# Altium schematic sheet practice_0.SchDoc: MCU STM32-F4 Example Board
size 381 x 241 mm; SheetNumber: 1; SheetTotal: 1
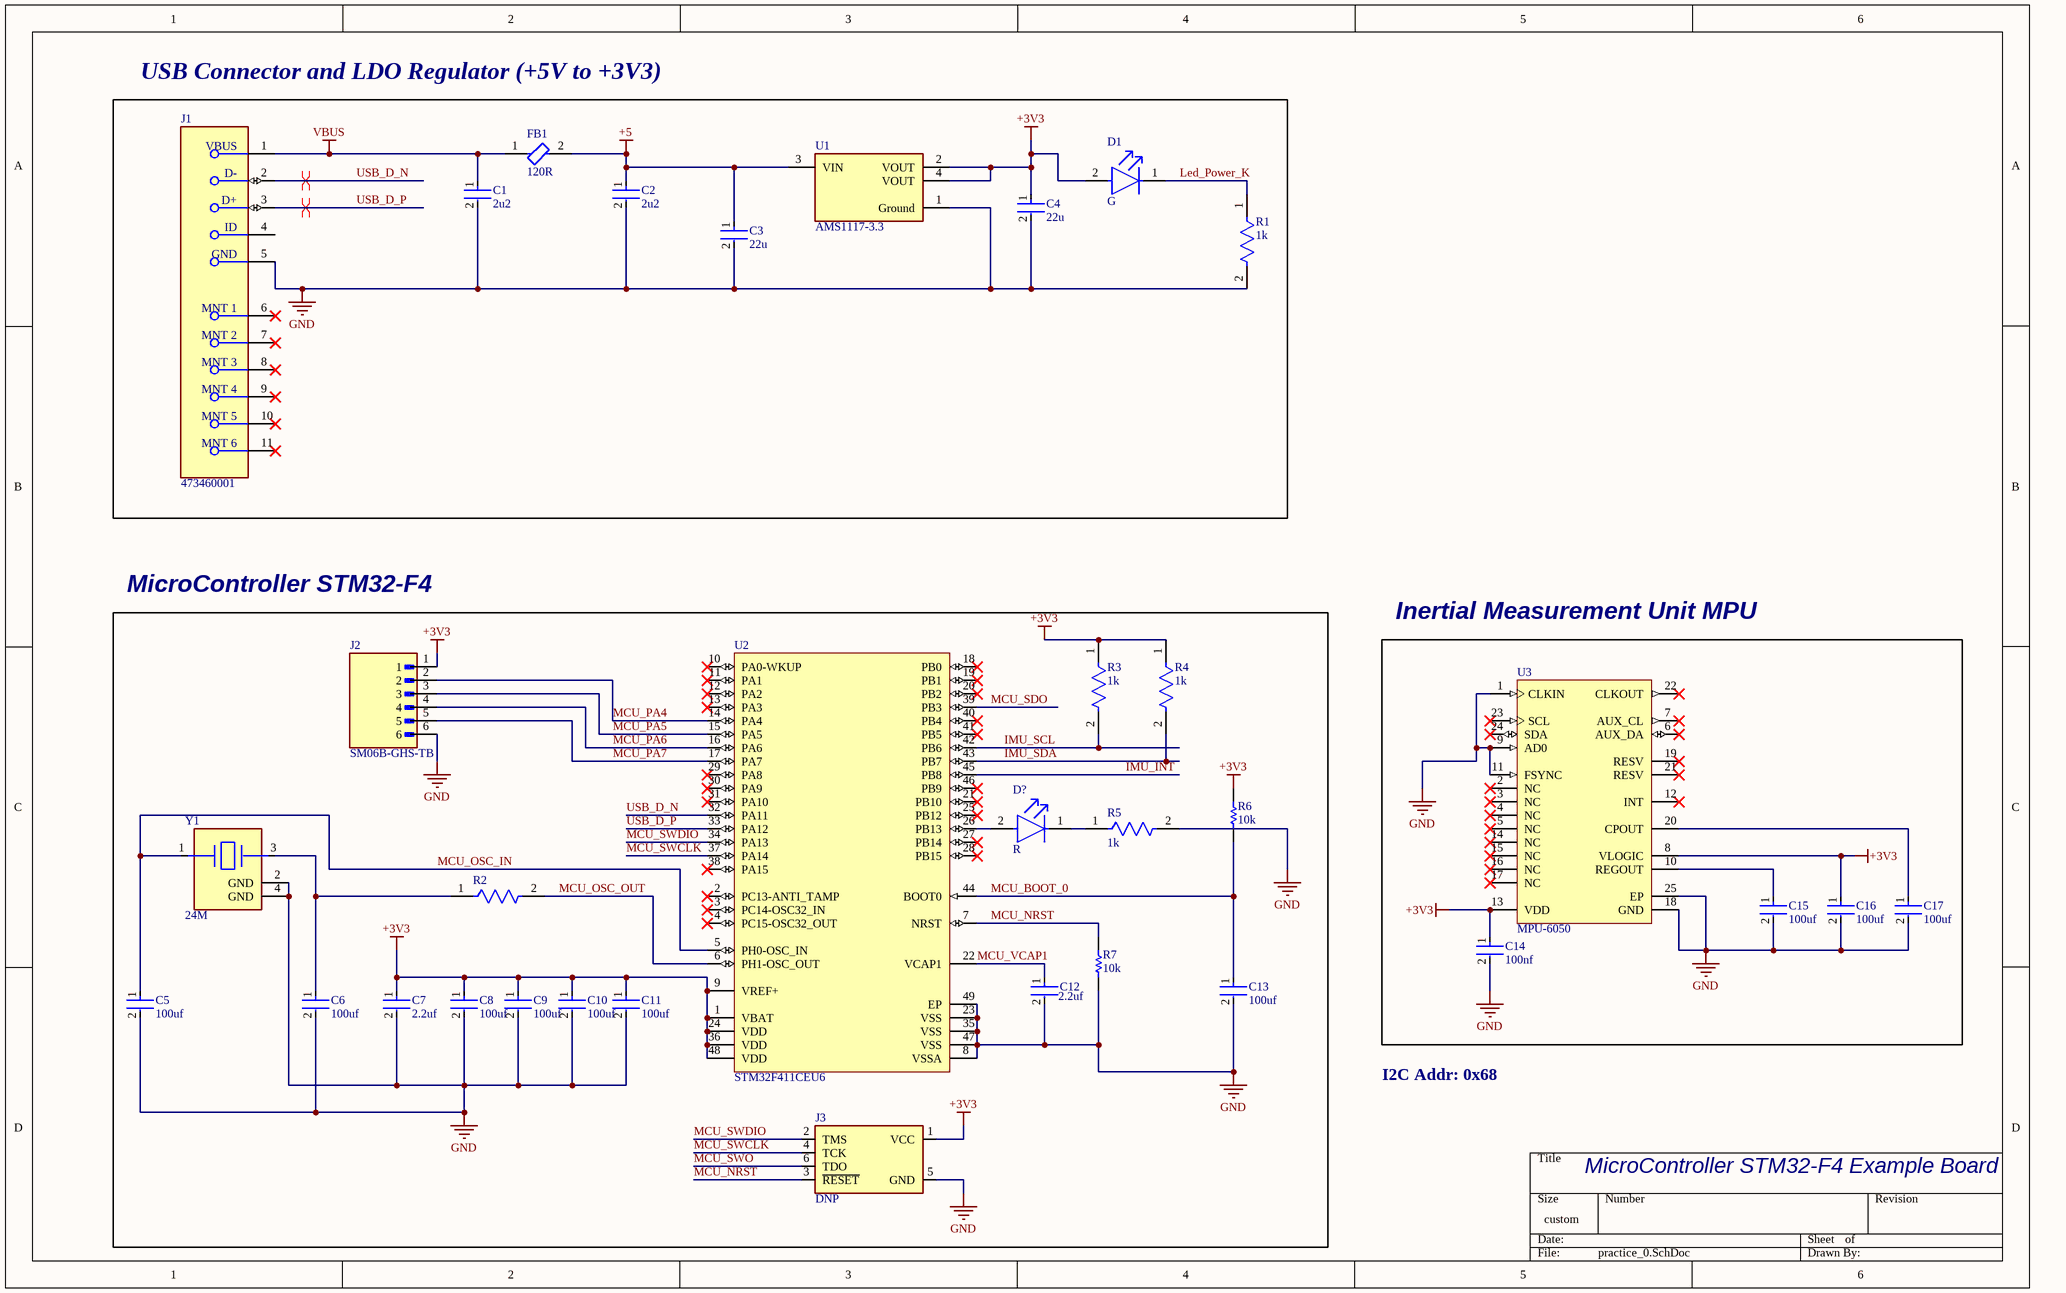
[diagram p0: practice_0.SchDoc]

## Parts
C1  2u2  [FP-CC0402-CC-MFG]
C2  2u2  [FP-CC0402-CC-MFG]
C3  22u  [FP-CC0402-CC-MFG]
C4  22u  [FP-CC0402-CC-MFG]
C5  100uf  [FP-C0402-BB-MFG]
C6  100uf  [FP-C0402-BB-MFG]
C7  2.2uf  [FP-CC0402-CC-MFG]
C8  100uf  [FP-C0402-BB-MFG]
C9  100uf  [FP-C0402-BB-MFG]
C10  100uf  [FP-C0402-BB-MFG]
C11  100uf  [FP-C0402-BB-MFG]
C12  2.2uf  [FP-CC0402-CC-MFG]
C13  100uf  [FP-C0402-BB-MFG]
C14  100nf  [FP-C0402-BB-MFG]
C15  100uf  [FP-C0402-BB-MFG]
C16  100uf  [FP-C0402-BB-MFG]
C17  100uf  [FP-C0402-BB-MFG]
D1  G  [FP-LTST-C193KGKT-5A-MFG]
D?  R  [FP-LTST-C230EKT-MFG]
FB1  120R  [FP-BLM18-0_15-t0_8-MFG]
J1  473460001  [FP-473460001-MFG]
J2  SM06B-GHS-TB  [JST_SM06B-GHS-TB]
J3  DNP  [TC2030-IDC-NL]
R1  1k  [FP-CSR0402-MFG]
R2  (no value)  [FP-CSR0402-MFG]
R3  1k  [FP-CSR0402-MFG]
R4  1k  [FP-CSR0402-MFG]
R5  1k  [FP-CSR0402-MFG]
R6  10k  [RESC1005X40X20NL05T10]
R7  10k  [RESC1005X40X20NL05T10]
U1  AMS1117-3.3  [FP-AMS1117-IPC_C]
U2  STM32F411CEU6  [STM-UFQFPN48_L]
U3  MPU-6050  [IS-QFN-24_V]
Y1  24M  [FP-TSX-3225-MFG]

## Blocks framed on the sheet
USB Connector and LDO Regulator (+5V to +3V3): C1-C4 D1 FB1 J1 R1 U1
MicroController STM32-F4: C5-C13 D? J2 J3 R2-R7 U2 Y1
Inertial Measurement Unit MPU: C14-C17 U3

## Nets
+3V3: C4.1 C7.1 C8.1 C9.1 C10.1 C11.1 C14.1 C16.1 D1.2(A) J2.1 J3.1(VCC) R3.1 R4.1 R6.2 U1.2(VOUT) U1.4(VOUT) U2.1(VBAT) U2.9(VREF+) U2.24(VDD) U2.36(VDD) U2.48(VDD) U3.8(VLOGIC) U3.13(VDD)
+5: C2.1 C3.1 FB1.2 U1.3(VIN)
GND: C1.2 C2.2 C3.2 C4.2 C5.2 C6.2 C7.2 C8.2 C9.2 C10.2 C11.2 C12.2 C13.2 C14.2 C15.2 C16.2 C17.2 J1.5(GND) J2.6 J3.5(GND) R1.2 R5.2 R7.1 U1.1(Ground) U2.8(VSSA) U2.23(VSS) U2.35(VSS) U2.47(VSS) U2.49(EP) U3.1(CLKIN) U3.9(AD0) U3.11(FSYNC) U3.18(GND) U3.25(EP) Y1.2(GND) Y1.4(GND)
VBUS: C1.1 FB1.1 J1.1(VBUS)
IMU_INT: U2.45(PB8)
IMU_SCL: R3.2 U2.42(PB6)
IMU_SDA: R4.2 U2.43(PB7)
Led_Power_K: D1.1(C) R1.1
MCU_BOOT_0: C13.1 R6.1 U2.44(BOOT0)
MCU_NRST: J3.3(~{RESET}) R7.2 U2.7(NRST)
MCU_OSC_IN: C5.1 U2.5(PH0-OSC_IN) Y1.1
MCU_OSC_OUT: R2.2 U2.6(PH1-OSC_OUT)
MCU_PA4: J2.2 U2.14(PA4)
MCU_PA5: J2.3 U2.15(PA5)
MCU_PA6: J2.4 U2.16(PA6)
MCU_PA7: J2.5 U2.17(PA7)
MCU_SDO: U2.39(PB3)
MCU_SWCLK: J3.4(TCK) U2.37(PA14)
MCU_SWDIO: J3.2(TMS) U2.34(PA13)
MCU_SWO: J3.6(TDO)
MCU_VCAP1: C12.1 U2.22(VCAP1)
USB_D_N: J1.2(D-) U2.32(PA11)
USB_D_P: J1.3(D+) U2.33(PA12)
NetC6_1: C6.1 R2.1 Y1.3
NetC15_1: C15.1 U3.10(REGOUT)
NetC17_1: C17.1 U3.20(CPOUT)
NetD?_1: D?.1(C) R5.1
NetD?_2: D?.2(A) U2.26(PB13)

Not connected (* = marked no-connect by the designer): J1 4(ID) 6(MNT_1)* 7(MNT_2)* 8(MNT_3)* 9(MNT_4)* 10(MNT_5)* 11(MNT_6)*; U2 2(PC13-ANTI_TAMP)* 3(PC14-OSC32_IN)* 4(PC15-OSC32_OUT)* 10(PA0-WKUP)* 11(PA1)* 12(PA2)* 13(PA3)* 18(PB0)* 19(PB1)* 20(PB2)* 21(PB10)* 25(PB12)* 27(PB14)* 28(PB15)* 29(PA8)* 30(PA9)* 31(PA10)* 38(PA15)* 40(PB4)* 41(PB5)* 46(PB9)*; U3 2(NC)* 3(NC)* 4(NC)* 5(NC)* 6(AUX_DA)* 7(AUX_CL)* 12(INT)* 14(NC)* 15(NC)* 16(NC)* 17(NC)* 19(RESV)* 21(RESV)* 22(CLKOUT)* 23(SCL)* 24(SDA)*

## Layout directives
differential pair; differential pair class DIFF_USB: USB_D_N, USB_D_P

## Notes on the sheet
- I2C Addr: 0x68
- MicroController STM32-F4 Example Board

## Library data of the parts
C1-C4 C7 C12 = CMP-03422-000732-3: CAP CER 2.2UF 16V X5R 0402; Tolerance: 10%; Case Code (Imperial): 0402; Width: 0.5mm; Max Operating Temperature: 85°C; Length: 0.039inch; Thickness: 0.022inch; Termination: SMD/SMT; Halogen Free: Halogen Free; Voltage Rating (DC): 16V; Packaging: Tape and Reel; RoHS Compliant: Yes; Lead Free: Lead Free; Weight: 2.3E-05oz; Package Quantity: 5000; Height: 0.5mm; Case Code (Metric): 1005; Dielectric: X5R; Case/Package: 0402; Capacitance: 2.2uF; Mount: Surface Mount; Voltage Rating: 16V; Min Operating Temperature: -55°C
C5 C6 C8-C11 C13-C17 = CMP-1034-01425-3: Capacitor, Ceramic, 330Pf, 16Vdc, 10-% Tol, 10+% Tol, X7r-Tc Code, -15, 15%-Tc Rohs Compliant: Yes; Manufacturer Part Number: C0402C331K4RACTU; Manufacturer: Kemet; Voltage Rating: 16 V; Temperature Characteristic: X7R; Tolerance: 0.1; Temperature Coefficient: 15%; Category: Cap; ComponentLink2Description: Datasheet; Lead Free: Yes; Mouser Description: Multilayer Ceramic Capacitors MLCC - SMD/SMT 16volts 330pF X7R 10%; Capacitance: 330 pF; Ipc Land Pattern Name: CAPC10050X50; Temperature Range High: +125°C; Temperature: -55°C to +125°C; Digikey Description: Capacitor, Ceramic, 330Pf, 16Vdc, 10-% Tol, 10+% Tol, X7r-Tc Code, -15, 15%-Tc Rohs Compliant: Yes; Automotive: No; Package: C0402-BB; Height: 0.55mm; Material: Ceramic; ComponentLink2URL: https://content.kemet.com/datasheets/KEM_C1002_X7R_SMD.pdf; Device Class L1: Passive Components; Temperature Range Low: -55°C; Value: 330 pF; Device Class L3: Ceramic Capacitors; Device Class L2: Capacitors; Octopart: https://octopart.com/c0402c331k4ractu-kemet-9139363; RoHS: TRUE
D1 = CMP-2000-06622-2: LED GREEN CLEAR CHIP SMD; Forward Current: 30mA; Power Dissipation: 75mW; Luminous Intensity: 28mcd; Lens Style: Diffused; Lens Color: Colorless; Forward Voltage: 2.3V; Test Current: 5mA; Viewing Angle: 130°; Reverse Voltage: 5V; Dominant Wavelength: 576.5nm; Number of Elements: 1; Number of Pins: 2; Case/Package: 0603; Width: 0.8mm; Radiation Hardening: No; Lead Free: Lead Free; Lens Transparency: Clear; Max Operating Temperature: 85°C; Illumination Color: Green; Color: Green; Packaging: Tape and Reel; Depth: 0.8mm; Length: 1.6mm; Mount: Surface Mount; Case Code (Imperial): 0603; Height: 0.35mm; Min Operating Temperature: -55°C; Package Quantity: 3000; Case Code (Metric): 1608; Power Rating: 75mW; Number of LEDs: 1
D? = CMP-22017-000030-1: LED RED CLEAR CHIP SMD; Forward Current: 30mA; Test Current: 10mA; Number of Elements: 1; Viewing Angle: 130°; Dominant Wavelength: 621nm; Forward Voltage: 2V; Lens Style: Diffused; Power Rating: 100mW; Reverse Voltage: 5V; Wavelength: 630nm; Luminous Intensity: 6mcd; Lens Color: Colorless; Case/Package: 1206; Case Code (Imperial): 1206; Package Quantity: 1; Lead Free: Lead Free; Case Code (Metric): 3216; Height: 1.1mm; Lens Transparency: Clear; Mount: Surface Mount; Depth: 1.6mm; Number of LEDs: 1; Power Dissipation: 100mW; Max Operating Temperature: 85°C; Width: 1.6mm; Color: Red; Number of Pins: 2; Min Operating Temperature: -55°C; Packaging: Tape and Reel; Radiation Hardening: No; Illumination Color: Red; Length: 3.2mm
FB1 = CMP-0686-00380-3: Chip Ferrite Bead, 0603, 120Ω @ 100MHz, 0.5Ω, 25%, 200mA; Resistance: 500mR; Material: Steel; Number of Lines: 1; Shielding: Unshielded; Max Current Rating: 200mA; Number of Pins: 2; Radiation Hardening: No; Termination: SMD/SMT; REACH SVHC: No SVHC; Packaging: Tape and Reel; Weight: 7.1E-05oz; Package Quantity: 4000; Tolerance: 25%; Max Operating Temperature: 125°C; Depth: 0.95mm; Test Frequency: 100MHz; Max DC Current: 200mA; Case Code (Imperial): 0603; Number of Circuits: 1; Height: 0.8mm; Core Material: Ferrite; Length: 1.6mm; Width: 0.8mm; Current Rating: 200mA; DC Current: 200mA; Case/Package: 0603; Min Operating Temperature: -55°C; Series: BLM18H; Impedance: 120R; DC Resistance (DCR): 500mR; Lead Free: Lead Free; Case Code (Metric): 1608
J1 = CMP-2000-05246-2: CONN RCPT USB2.0 MICRO B SMD R/A; Manufacturer: Molex; Conn Orientation: Right Angle; Is Female: yes; Shielding: true; Pitch: 0.65mm; Number Of Contacts: 5; Voltage Rating: 30V; Current Rating: 1.8A; Device Class L2: USB Connectors; Digikey Description: CONN RCPT USB2.0 MICRO B SMD R/A; Height: 2.945mm; RoHS: TRUE; ComponentLink2Description: Datasheet; Octopart: https://octopart.com/47346-0001-molex-7164928; Automotive: No; Package: 0; Category: Conn; Device Class L1: Connectors; Usb Standard: USB 2.0; Temperature: -30°C to +85°C; Temperature Range Low: -30°C; Footprint Url: https://www.molex.com/pdm_docs/sd/473460001_sd.pdf; ComponentLink2URL: https://www.molex.com/webdocs/datasheets/pdf/en-us/0473460001_IO_CONNECTORS.pdf; Lead Free: Yes; Manufacturer Part Number: 473460001; Contact Material: Gold,Nickel; Temperature Range High: +85°C; Device Class L3: unset
J2 = SM06B-GHS-TB: Connector Header Surface Mount, Right Angle 6 position 0.049 (1.25mm); MF: JST Sales; SnapEDA_Link: https://www.snapeda.com/parts/SM06B-GHS-TB/JST/view-part/?ref=snap; Package: None; Value: *; MP: SM06B-GHS-TB; Check_prices: https://www.snapeda.com/parts/SM06B-GHS-TB/JST/view-part/?ref=eda
J3 = TC2030-CTX: CortexÂ® Plug-Of-Nailsâ„¢ Adapter Cable; MF: Tag-Connect LLC; Availability: Unavailable; Package: None; MP: TC2030-CTX; SnapEDA_Link: https://www.snapeda.com/parts/TC2030-CTX/Tag-Connect%20LLC/view-part/225831/?ref=snap; Value: *; Price: None
R1-R5 = CMP-26527-006296-1: General Purpose Thick Film Chip Resistor, 0402, 0.5Ω, 5%, 200ppm/°C, 0.125W; Mount: Surface Mount; Tolerance: 5%; Min Operating Temperature: -55°C; RoHS Compliant: Yes; Max Operating Temperature: 155°C; Packaging: Tape and Reel
R6 R7 = CMP-2002-01682-1: Manufacturer: Vishay BCcomponents; Part Number: TNPW040210K0DEED
U1 = CMP-209535-000001-1: LDO Voltage Regulators 1A, 3.3V; Manufacturer: Advanced Monolithic Systems; Dropout Voltage: 1.1V; Output Type: Fixed; Nominal Supply Current: 5mA; Max Power Dissipation: 1.2W; Max Supply Voltage: 15V; Number Of Outputs: 1; Standoff Height: 0.64mm; Max Junction Temp: +125°C; Height: 1.8mm; Package: AMS1117; Device Class L2: Power Management ICs; ComponentLink2Description: Datasheet; ComponentLink2URL: http://www.advanced-monolithic.com/pdf/ds1117.pdf; Category: IC; RoHS: TRUE; Automotive: No; Device Class L1: Integrated Circuits (ICs); Output Current: 1A; Device Class L3: Voltage Regulators - Linear; Temperature: -40°C to +125°C; Output Voltage: 3.3V; Manufacturer Part Number: AMS1117-3.3; Temperature Range Low: -40°C; Octopart: https://octopart.com/ams1117-3.3-advanced+monolithic+systems-25899300; Lead Free: Yes; Ipc Land Pattern Name: SOT229P700X180-4; Temperature Range High: +125°C
U2 = CMP-0243-00165-1: ARM Cortex-M4 32-bit MCU+FPU, 512 KB Flash, 128 KB RAM, 36 I/Os, 48-Pin UFQFPN, -40 to 85 degC, Tray; Operating Frequency(F) (Processor speed) (MHz): 100; FLASH Size (Prog) (kB): 512; Internal RAM Size (kB): 128; I/Os (High Current): 36; Supply Voltage(Vcc) min (V): 1.7; Package Reference: 48-Pin Ultra Thin Fine Pitch Quad Flat No-Lead, 7 x 7 x 0.6 mm Body, 0.5 mm Pitch, Exposed Pad; ComponentLink1Description: Manufacturer URL; ComponentLink1URL: http://www.st.com/; Packing: Tray; Package Description: UFQFPN48; Core: ARM Cortex-M4; ComponentLink2Description: Datasheet; ComponentLink2URL: http://www.st.com/st-web-ui/static/active/en/resource/technical/document/datasheet/DM00115249.pdf; DatasheetVersion: Rev. 6; Mounting Technology: Surface Mount
U3 = CMP-1753-00002-2: 3-Axis Gyroscope, Accelerometer and a Digital Motion Processor(TM) (DMP), 2.375 to 3.46 V, -40 to 85 degC, 24-Pin QFN, RoHS, Tape and Reel; Manufacturer: InvenSense; Featured Product: MPU-60506-Axis,IntegratedI²CSolution; Other Names: 1428-1007-2 / MPU6050; Sensor Type: MotionTracking; Online Catalog: MPU-6000™Series; Unit PriceUSD: Digital; Datasheet Version: Rev. 3.3, 05/2012; Category: Sensors,Transducers; Datasheet URL: http://datasheet.octopart.com/MPU-6050-InvenSense-datasheet-14421344.pdf; Family: Multifunction; Standard Package: 5,000; Manufacturer URL: http://www.invensense.com/; Output Type: Digital; Dynamic Catalog: MPU-6000™Series
Y1 = CMP-36405-000018-1: CRYSTAL 24.0000MHZ 9PF SMD; ESR (Equivalent Series Resistance): 40R; Frequency Stability: 20ppm; Frequency: 24MHz; Tolerance: 10ppm; Drive Level: 200uW; Min Operating Temperature: -40°C; RoHS Compliant: Yes; Width: 2.5mm; Max Operating Temperature: 105°C; Package Quantity: 250; Load Capacitance: 9pF; Mount: Surface Mount; Lead Free: Lead Free; Height: 0.024inch; Depth: 2.5mm; Packaging: Tape and Reel; Series: TSX-3225; Weight: 0.000564oz; Number of Pins: 4; Termination: SMD/SMT; Case/Package: SMD/SMT; Length: 3.2mm; Frequency Tolerance: 10ppm